# EAGLE schematic DynoHub (EAGLE 9.6.2)
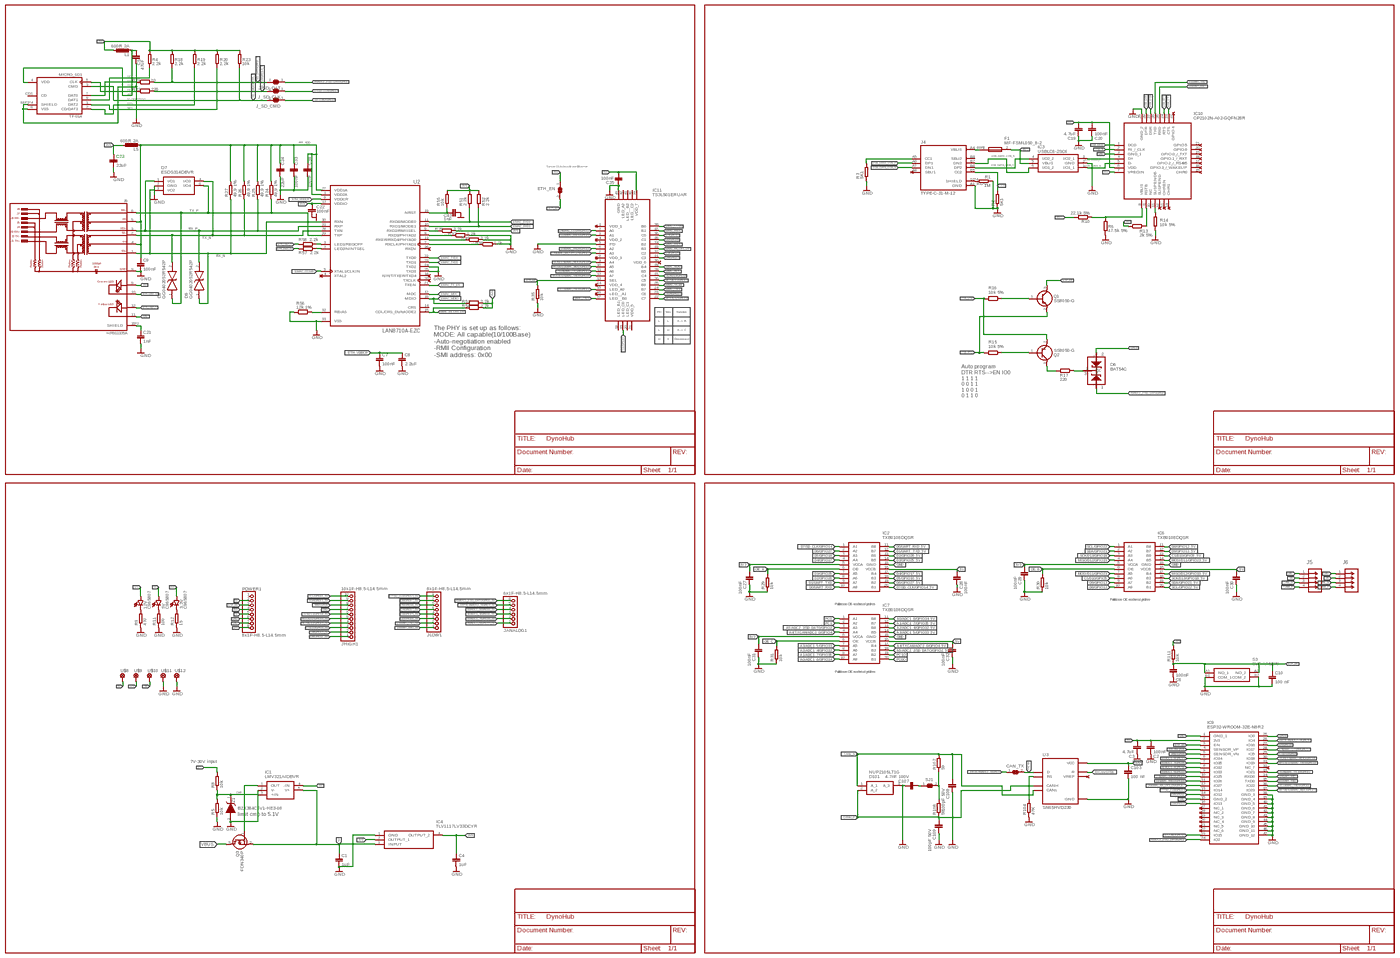
[diagram p0: schematic, sheet 1, overview]
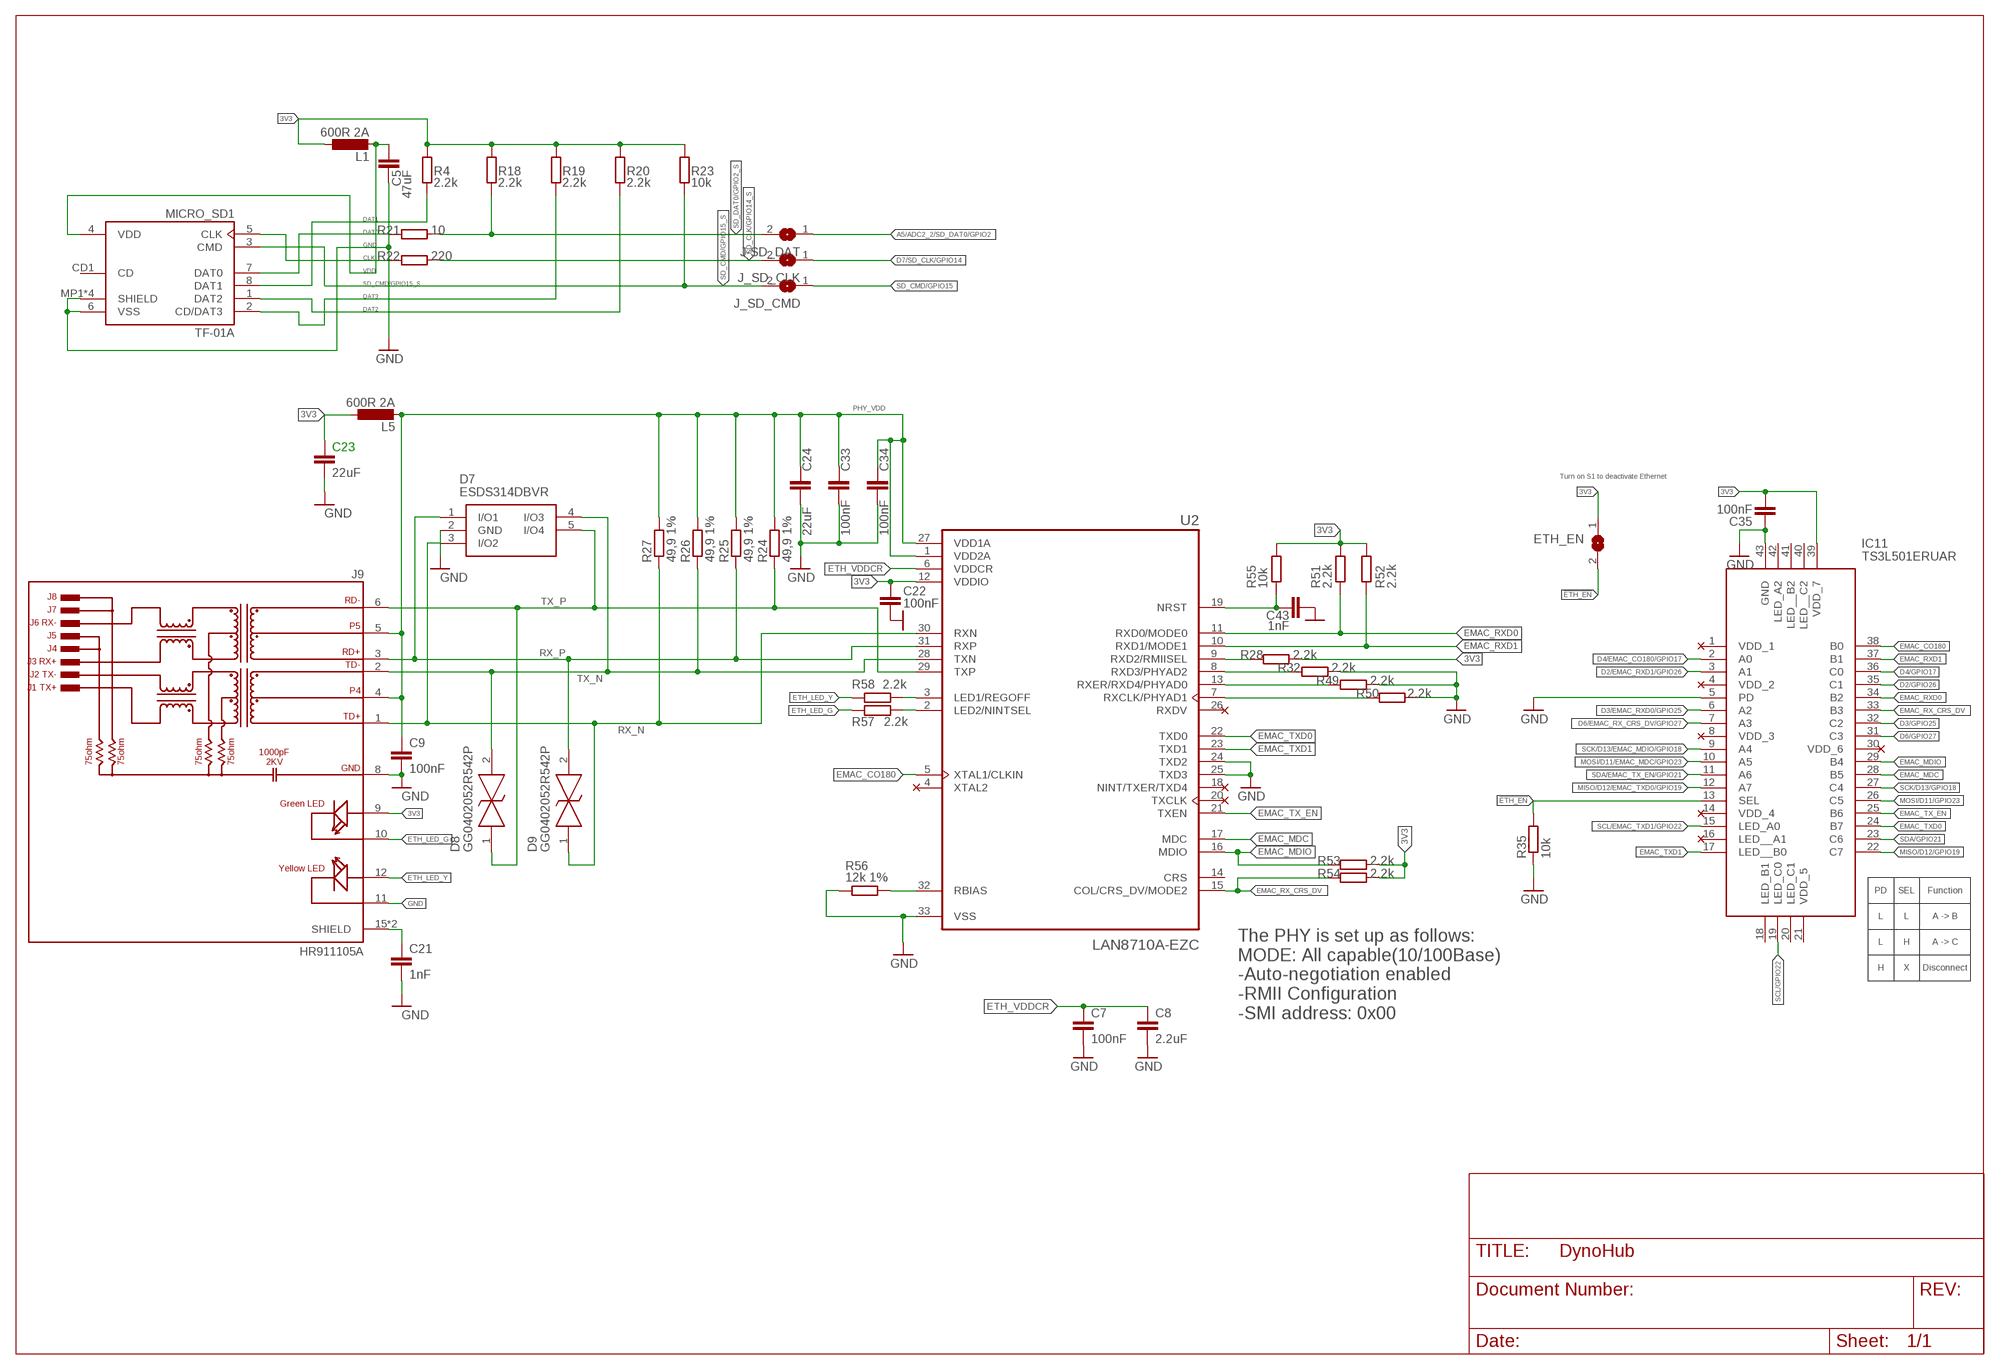
[diagram p1: schematic, sheet 1, part 1 of 4]
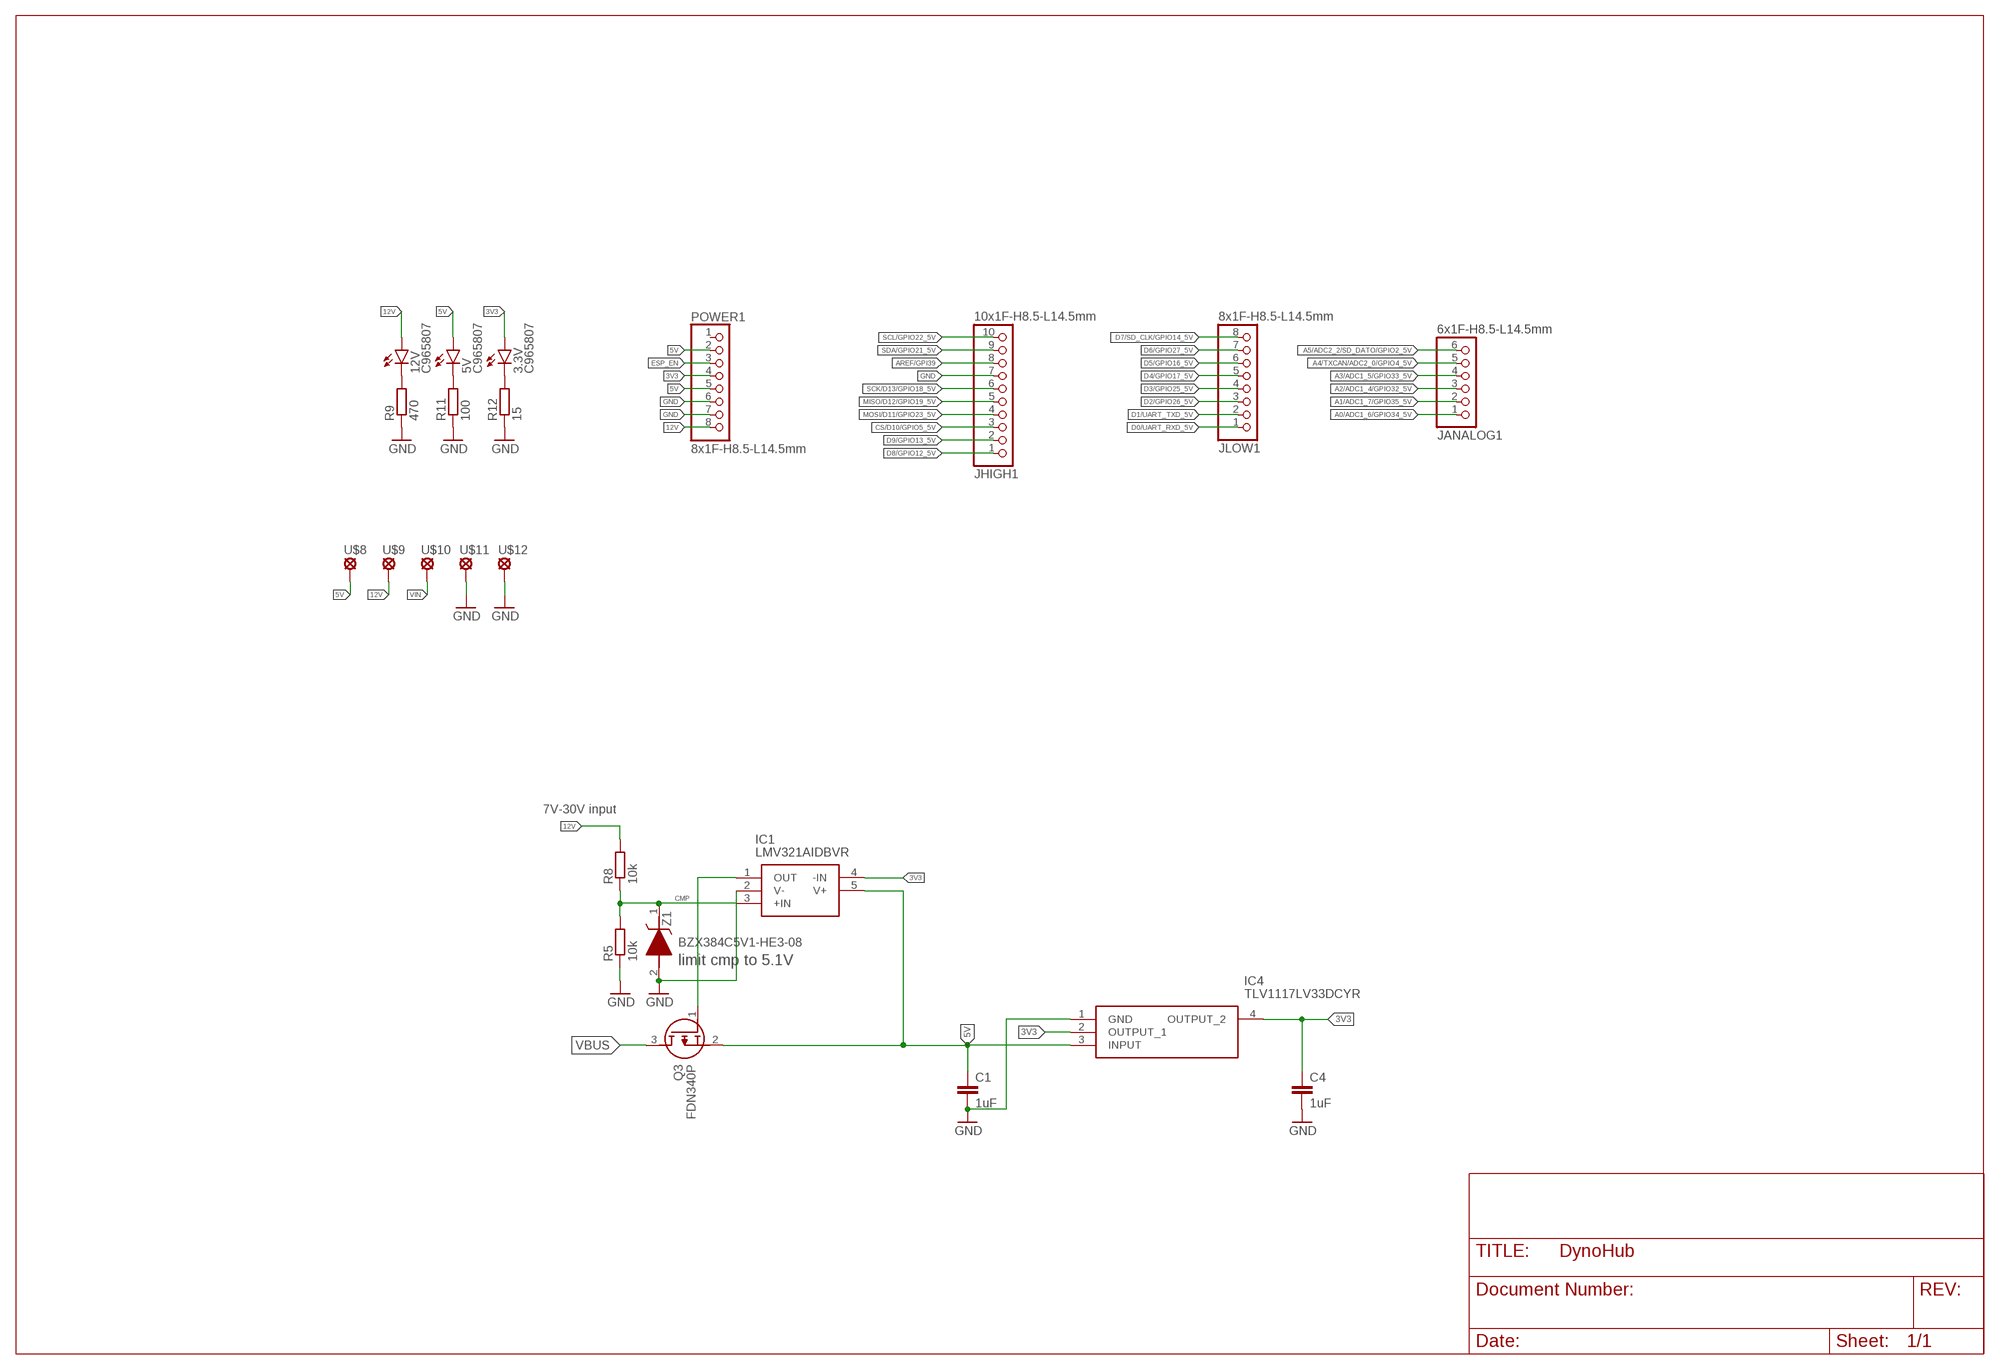
[diagram p2: schematic, sheet 1, part 2 of 4]
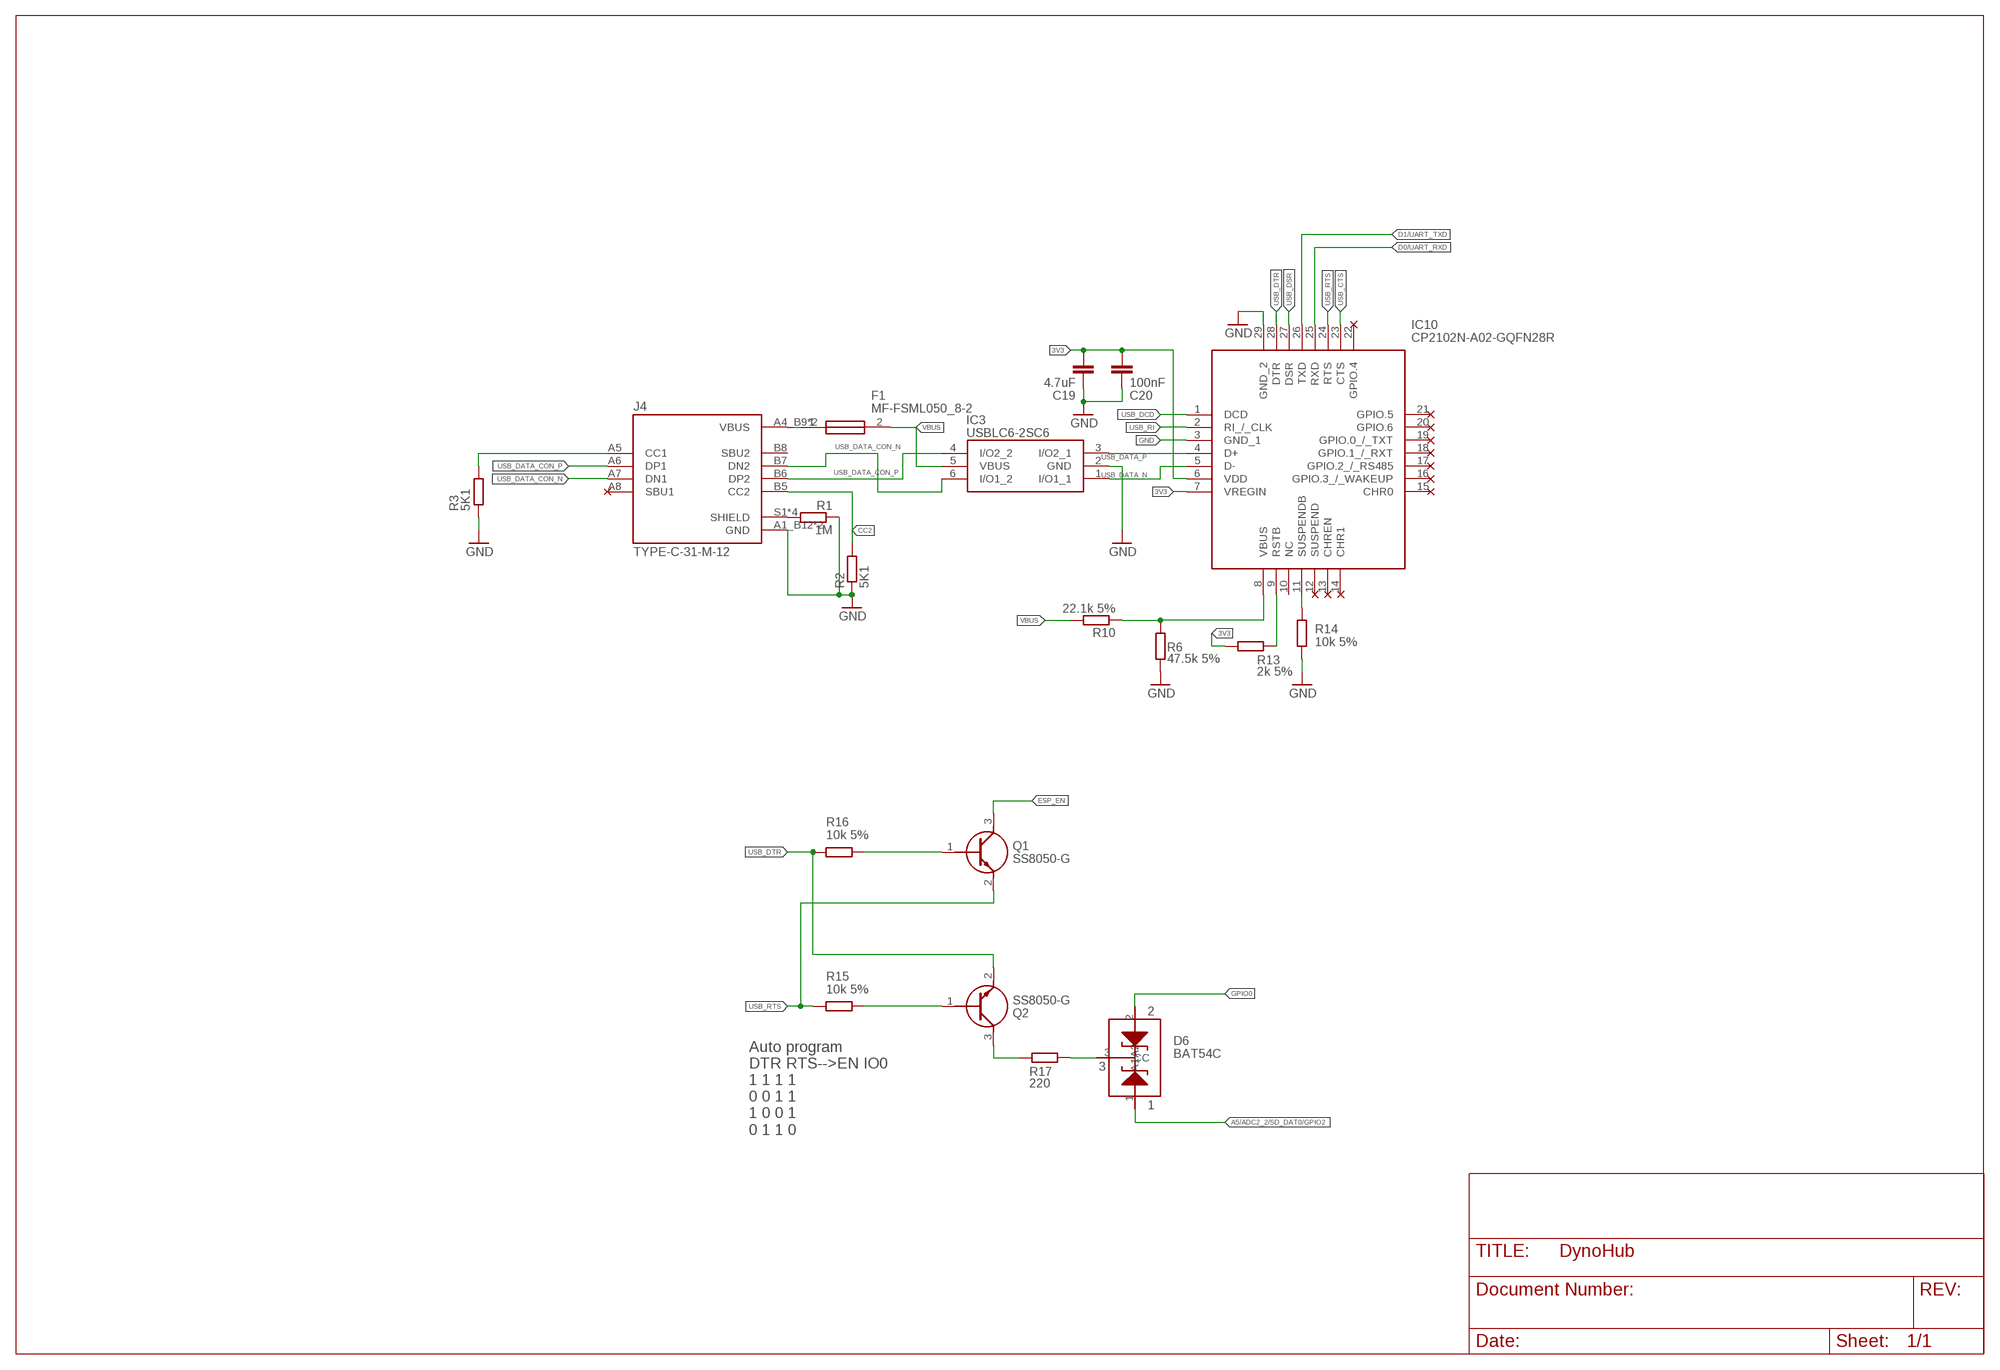
[diagram p3: schematic, sheet 1, part 3 of 4]
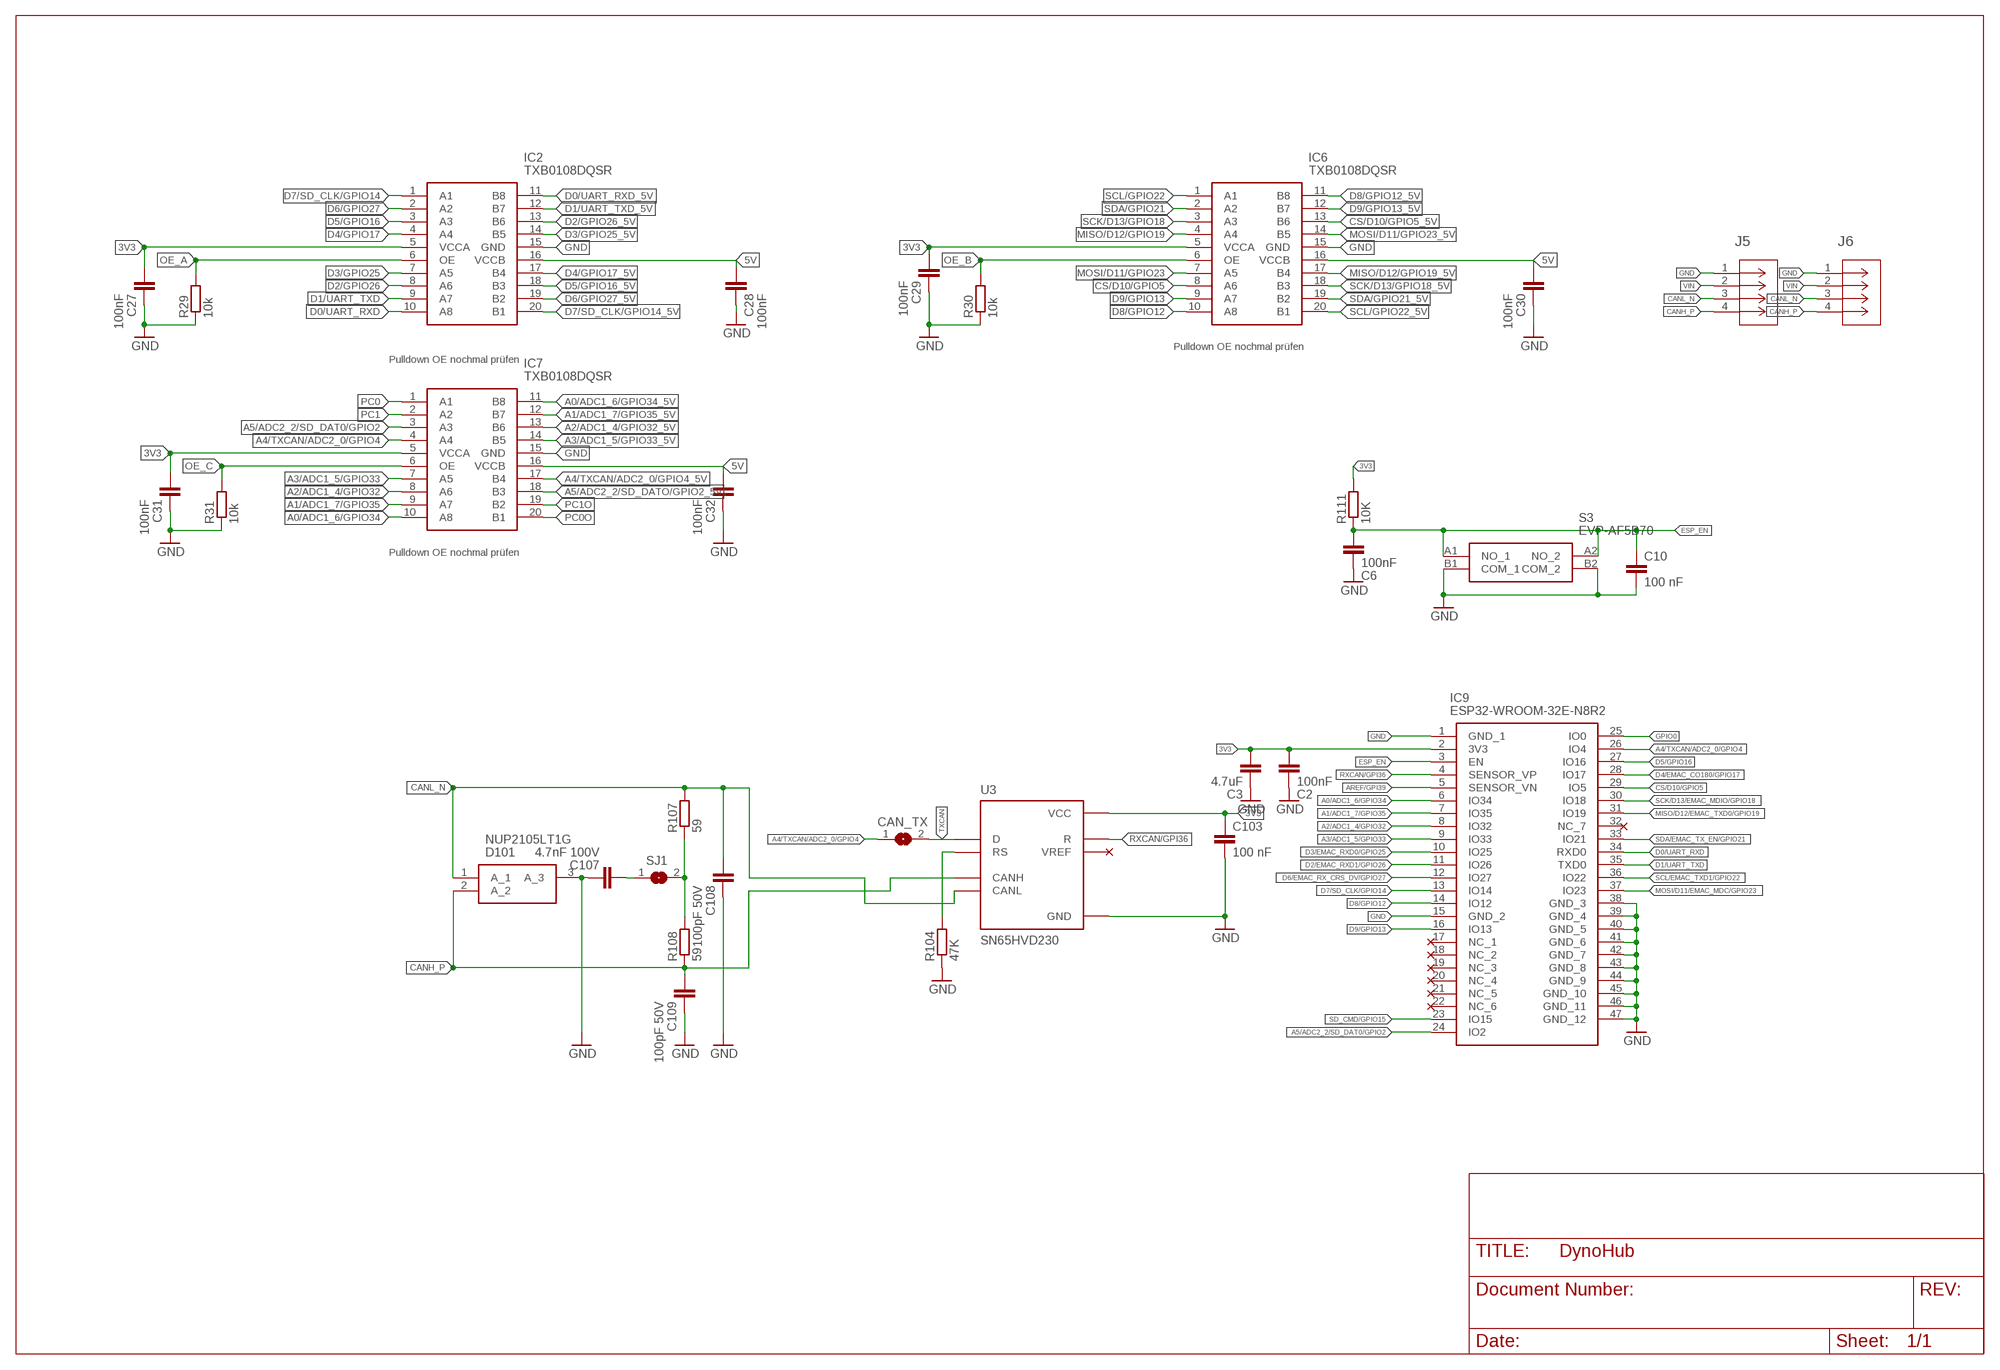
[diagram p4: schematic, sheet 1, part 4 of 4]

## Parts
3.3V  C965807  LEDCHIPLED_0603  [CHIPLED_0603]
5V  C965807  LEDCHIPLED_0603  [CHIPLED_0603]
12V  C965807  LEDCHIPLED_0603  [CHIPLED_0603]
C1  1uF  C-EUC0603  [C0603]
C2  100nF  C-EUC0402K  [C0402K]
C3  4.7uF  C-EUC0402K  [C0402K]
C4  1uF  C-EUC0603  [C0603]
C5  47uF  C-EUC0805  [C0805]
C6  100nF  C-EUC0402K  [C0402K]
C7  100nF  C-EUC0402K  [C0402K]
C8  2.2uF  C-EUC0402K  [C0402K]
C9  100nF  C-EUC0402K  [C0402K]
C10  100 nF  C-EUC0402K  [C0402K]
C19  4.7uF  C-EUC0603  [C0603]
C20  100nF  C-EUC0402K  [C0402K]
C21  1nF  C-EUC0402K  [C0402K]
C22  100nF  C-EUC0402K  [C0402K]
C23  22uF  C-EUC0603  [C0603]
C24  22uF  C-EUC0603  [C0603]
C27  100nF  C-EUC0603  [C0603]
C28  100nF  C-EUC0603  [C0603]
C29  100nF  C-EUC0402K  [C0402K]
C30  100nF  C-EUC0402K  [C0402K]
C31  100nF  C-EUC0603  [C0603]
C32  100nF  C-EUC0603  [C0603]
C33  100nF  C-EUC0402K  [C0402K]
C34  100nF  C-EUC0402K  [C0402K]
C35  100nF  C-EUC0402K  [C0402K]
C43  1nF  C-EUC0402K  [C0402K]
C103  100 nF  C-EUC0402K  [C0402K]
C107  4.7nF 100V  C-EUC0603  [C0603]
C108  100pF 50V  C-EUC0603  [C0603]
C109  100pF 50V  C-EUC0603  [C0603]
CAN_TX  SJ  [SJ]
D6  BAT54C  [SOT95P240X120-3N]
D7  ESDS314DBVR  [SOT95P280X145-5N]
D8  GG0402052R542P  [DIONC1006X55N]
D9  GG0402052R542P  [DIONC1006X55N]
D101  NUP2105LT1G  [SOT96P237X111-3N]
ETH_EN  SJ  [SJ]
F1  MF-FSML050_8-2  [FUSC1608X70N]
IC1  LMV321AIDBVR  [SOT95P280X145-5N]
IC2  TXB0108DQSR  [TXB0108DQSR]
IC3  USBLC6-2SC6  [SOT95P280X145-6N]
IC4  TLV1117LV33DCYR  [SOT230P700X180-4N]
IC6  TXB0108DQSR  [TXB0108DQSR]
IC7  TXB0108DQSR  [TXB0108DQSR]
IC9  ESP32-WROOM-32E-N8R2  [ESP32WROOM32EN8R2]
IC10  CP2102N-A02-GQFN28R  [QFN50P500X500X80-29N]
IC11  TS3L501ERUAR  [QFN50P350X900X80-43N]
J4  TYPE-C-31-M-12  [HRO_TYPE-C-31-M-12]
J5  1718570004CONN_SD-171857-0001_M265_04_MO  [CONN_SD-171857-0001_M265_04_MO]
J6  1718570004CONN_SD-171857-0001_M265_04_MO  [CONN_SD-171857-0001_M265_04_MO]
J9  HR911105A  [HANRUN_HR911105A]
J-SD_DAT  SJ  [SJ]
J_SD_CLK  SJ  [SJ]
J_SD_CMD  SJ  [SJ]
JANALOG1  6x1F-H8.5-L14.5mm  PINHD-1X6  [1X06]
JHIGH1  10x1F-H8.5-L14.5mm  PINHD-1X10  [1X10]
JLOW1  8x1F-H8.5-L14.5mm  PINHD-1X8  [1X08]
L1  600R 2A  L-EUL2012C  [L2012C]
L5  600R 2A  L-EUL2012C  [L2012C]
MICRO_SD1  TF-01A  [TF-01A]
POWER1  8x1F-H8.5-L14.5mm  PINHD-1X8  [1X08]
Q1  SS8050-G  [SOT95P240X115-3N]
Q2  SS8050-G  [SOT95P240X115-3N]
Q3  FDN340P  [SOT95P237X112-3N]
R1  1M  R-EU_R0603  [R0603]
R2  5K1  R-EU_R0603  [R0603]
R3  5K1  R-EU_R0603  [R0603]
R4  2.2k  R-EU_R0402  [R0402]
R5  10k  R-EU_R0603  [R0603]
R6  47.5k 5%  R-EU_R0402  [R0402]
R8  10k  R-EU_R0603  [R0603]
R9  470  R-EU_R0603  [R0603]
R10  22.1k 5%  R-EU_R0402  [R0402]
R11  100  R-EU_R0603  [R0603]
R12  15  R-EU_R0603  [R0603]
R13  2k 5%  R-EU_R0402  [R0402]
R14  10k 5%  R-EU_R0402  [R0402]
R15  10k 5%  R-EU_R0402  [R0402]
R16  10k 5%  R-EU_R0402  [R0402]
R17  220  R-EU_R0402  [R0402]
R18  2.2k  R-EU_R0402  [R0402]
R19  2.2k  R-EU_R0402  [R0402]
R20  2.2k  R-EU_R0402  [R0402]
R21  10  R-EU_R0402  [R0402]
R22  220  R-EU_R0402  [R0402]
R23  10k  R-EU_R0402  [R0402]
R24  49,9 1%  R-EU_R0402  [R0402]
R25  49,9 1%  R-EU_R0402  [R0402]
R26  49,9 1%  R-EU_R0402  [R0402]
R27  49,9 1%  R-EU_R0402  [R0402]
R28  2.2k  R-EU_R0402  [R0402]
R29  10k  R-EU_R0603  [R0603]
R30  10k  R-EU_R0402  [R0402]
R31  10k  R-EU_R0603  [R0603]
R32  2.2k  R-EU_R0402  [R0402]
R35  10k  R-EU_R0603  [R0603]
R49  2.2k  R-EU_R0402  [R0402]
R50  2.2k  R-EU_R0402  [R0402]
R51  2.2k  R-EU_R0402  [R0402]
R52  2.2k  R-EU_R0402  [R0402]
R53  2.2k  R-EU_R0603  [R0603]
R54  2.2k  R-EU_R0603  [R0603]
R55  10k  R-EU_R0402  [R0402]
R56  12k 1%  R-EU_R0402  [R0402]
R57  2.2k  R-EU_R0402  [R0402]
R58  2.2k  R-EU_R0402  [R0402]
R104  47K  R-EU_R0603  [R0603]
R107  59  R-EU_R0603  [R0603]
R108  59  R-EU_R0603  [R0603]
R111  10K  R-EU_R0402  [R0402]
S3  EVP-AF5B70  [EVPAF5B70]
SJ1  SJ  [SJ]
U2  LAN8710A-EZC  [QFN50P500X500X100-33N]
U3  SN65HVD230  [SOIC127P599X175-8N]
U$1  NC  [NC]
U$2  NC  [NC]
U$3  NC  [NC]
U$4  NC  [NC]
U$5  NC  [NC]
U$6  NC  [NC]
U$7  NC  [NC]
U$8  2X3MM_PAD  [2X3MM_PAD]
U$9  2X3MM_PAD  [2X3MM_PAD]
U$10  2X3MM_PAD  [2X3MM_PAD]
U$11  2X3MM_PAD  [2X3MM_PAD]
U$12  2X3MM_PAD  [2X3MM_PAD]
U$13  NC  [NC]
U$14  NC  [NC]
U$15  NC  [NC]
U$16  NC  [NC]
U$17  NC  [NC]
U$18  NC  [NC]
U$19  NC  [NC]
U$20  NC  [NC]
U$21  NC  [NC]
U$22  NC  [NC]
U$23  NC  [NC]
U$24  NC  [NC]
U$25  NC  [NC]
U$26  NC  [NC]
U$27  NC  [NC]
U$28  NC  [NC]
U$29  NC  [NC]
U$30  NC  [NC]
U$31  NC  [NC]
U$32  NC  [NC]
U$33  NC  [NC]
U$34  NC  [NC]
U$35  NC  [NC]
Z1  BZX384C5V1-HE3-08  [SOD2713X115N]

## Nets
3V3: 3.3V.A C2.1 C3.1 C4.1 C19.1 C20.1 C22.1 C23.1 C27.2 C29.2 C31.2 C35.2 C103.1 ETH_EN.1 IC1.4(-IN) IC2.5(VCCA) IC4.2(OUTPUT_1) IC4.4(OUTPUT_2) IC6.5(VCCA) IC7.5(VCCA) IC9.2(3V3) IC10.6(VDD) IC10.7(VREGIN) IC11.39(VDD_7) J9.9(GA) L1.1 L5.1 POWER1.4 R4.2 R13.1 R18.2 R19.2 R20.2 R23.2 R28.2 R51.2 R52.2 R53.2 R54.2 R55.2 R111.2 U2.12(VDDIO) U3.3(VCC)
5V: 5V.A C1.1 C28.2 C30.2 C32.2 IC1.5(V+) IC2.16(VCCB) IC4.3(INPUT) IC6.16(VCCB) IC7.16(VCCB) POWER1.2 POWER1.5 Q3.2(S) U$8.P$1(MP)
12V: 12V.A POWER1.8 R8.2 U$9.P$1(MP)
!ETH_EN: ETH_EN.2 IC11.13(SEL) R35.2
A0/ADC1_6/GPIO34: IC7.10(A8) IC9.6(IO34)
A0/ADC1_6/GPIO34_5V: IC7.11(B8) JANALOG1.1
A1/ADC1_7/GPIO35: IC7.9(A7) IC9.7(IO35)
A1/ADC1_7/GPIO35_5V: IC7.12(B7) JANALOG1.2
A2/ADC1_4/GPIO32: IC7.8(A6) IC9.8(IO32)
A2/ADC1_4/GPIO32_5V: IC7.13(B6) JANALOG1.3
A3/ADC1_5/GPIO33: IC7.7(A5) IC9.9(IO33)
A3/ADC1_5/GPIO33_5V: IC7.14(B5) JANALOG1.4
A4/TXCAN/ADC2_0/GPIO4: CAN_TX.1 IC7.4(A4) IC9.26(IO4)
A4/TXCAN/ADC2_0/GPIO4_5V: IC7.17(B4) JANALOG1.5
A5/ADC2_2/SD_DAT0/GPIO2: D6.1(A1) IC7.3(A3) IC9.24(IO2) J-SD_DAT.1
A5/ADC2_2/SD_DATO/GPIO2_5V: IC7.18(B3) JANALOG1.6
AREF/GPI39: IC9.5(SENSOR_VN) JHIGH1.8
CANGND_BF_C: C107.2 SJ1.1
CANH_P [diffpairs]: C109.2 D101.2(A_2) J5.4 J6.4 R108.1 U3.7(CANH)
CANL_BF_JMP: R107.1 R108.2 SJ1.2
CANL_N [diffpairs]: C108.2 D101.1(A_1) J5.3 J6.3 R107.2 U3.6(CANL)
CC1: J4.A5(CC1) R3.2
CC2: J4.B5(CC2) R2.2
CLK: MICRO_SD1.5(CLK) R22.1
CMP: IC1.3(+IN) R5.2 R8.1 Z1.1(K)
CS/D10/GPIO5: IC6.8(A6) IC9.29(IO5)
CS/D10/GPIO5_5V: IC6.13(B6) JHIGH1.3
D0/UART_RXD: IC2.10(A8) IC9.34(RXD0) IC10.25(RXD)
D0/UART_RXD_5V: IC2.11(B8) JLOW1.1
D1/UART_TXD: IC2.9(A7) IC9.35(TXD0) IC10.26(TXD)
D1/UART_TXD_5V: IC2.12(B7) JLOW1.2
D2/EMAC_RXD1/GPIO26: IC9.11(IO26) IC11.3(A1)
D2/GPIO26: IC2.8(A6) IC11.35(C1)
D2/GPIO26_5V: IC2.13(B6) JLOW1.3
D3/EMAC_RXD0/GPIO25: IC9.10(IO25) IC11.6(A2)
D3/GPIO25: IC2.7(A5) IC11.32(C2)
D3/GPIO25_5V: IC2.14(B5) JLOW1.4
D4/EMAC_CO180/GPIO17: IC9.28(IO17) IC11.2(A0)
D4/GPIO17: IC2.4(A4) IC11.36(C0)
D4/GPIO17_5V: IC2.17(B4) JLOW1.5
D5/GPIO16: IC2.3(A3) IC9.27(IO16)
D5/GPIO16_5V: IC2.18(B3) JLOW1.6
D6/EMAC_RX_CRS_DV/GPIO27: IC9.12(IO27) IC11.7(A3)
D6/GPIO27: IC2.2(A2) IC11.31(C3)
D6/GPIO27_5V: IC2.19(B2) JLOW1.7
D7/SD_CLK/GPIO14: IC2.1(A1) IC9.13(IO14) J_SD_CLK.1
D7/SD_CLK/GPIO14_5V: IC2.20(B1) JLOW1.8
D8/GPIO12: IC6.10(A8) IC9.14(IO12)
D8/GPIO12_5V: IC6.11(B8) JHIGH1.1
D9/GPIO13: IC6.9(A7) IC9.16(IO13)
D9/GPIO13_5V: IC6.12(B7) JHIGH1.2
DAT0: MICRO_SD1.7(DAT0) R21.1
DAT1: MICRO_SD1.8(DAT1) R4.1
DAT2: MICRO_SD1.1(DAT2) R20.1
DAT3: MICRO_SD1.2(CD/DAT3) R19.1
EMAC_CO180: IC11.38(B0) U2.5(XTAL1/CLKIN)
EMAC_MDC: IC11.28(B5) U2.17(MDC)
EMAC_MDIO: IC11.29(B4) R53.1 U2.16(MDIO)
EMAC_RX_CRS_DV: IC11.33(B3) R54.1 U2.15(COL/CRS_DV/MODE2)
EMAC_RXD0: IC11.34(B2) R51.1 U2.11(RXD0/MODE0)
EMAC_RXD1: IC11.37(B1) R52.1 U2.10(RXD1/MODE1)
EMAC_TX_EN: IC11.25(B6) U2.21(TXEN)
EMAC_TXD0: IC11.24(B7) U2.22(TXD0)
EMAC_TXD1: IC11.17(LED__B0) U2.23(TXD1)
ESP_EN: C6.1 C10.1 IC9.3(EN) POWER1.3 Q1.3(C) R111.1 S3.A1(NO_1) S3.A2(NO_2)
ETH_LED_G: J9.10(GC) R57.2
ETH_LED_Y: J9.12(YA) R58.2
ETH_VDDCR: C7.1 C8.1 U2.6(VDDCR)
GND: C1.2 C2.2 C3.2 C4.2 C5.1 C6.2 C7.2 C8.2 C9.2 C10.2 C19.2 C20.2 C21.2 C22.2 C23.2 C24.2 C27.1 C28.1 C29.1 C30.1 C31.1 C32.1 C33.2 C34.2 C35.1 C43.2 C103.2 C107.1 C108.1 C109.1 D7.2(GND) D101.3(A_3) IC1.2(V-) IC2.15(GND) IC3.2(GND) IC4.1(GND) IC6.15(GND) IC7.15(GND) IC9.1(GND_1) IC9.15(GND_2) IC9.38(GND_3) IC9.39(GND_4) IC9.40(GND_5) IC9.41(GND_6) IC9.42(GND_7) IC9.43(GND_8) IC9.44(GND_9) IC9.45(GND_10) IC9.46(GND_11) IC9.47(GND_12) IC10.3(GND_1) IC10.29(GND_2) IC11.5(PD) IC11.43(GND) J4.A1_B12(GND) J4.B1_A12(GND) J5.1 J6.1 J9.8(GND) J9.11(YC) JHIGH1.7 MICRO_SD1.6(VSS) MICRO_SD1.MP1(SHIELD) MICRO_SD1.MP2(SHIELD) MICRO_SD1.MP3(SHIELD) MICRO_SD1.MP4(SHIELD) POWER1.6 POWER1.7 R1.1 R2.1 R3.1 R5.1 R6.1 R9.1 R11.1 R12.1 R14.1 R29.1 R30.1 R31.1 R32.2 R35.1 R49.2 R50.2 R56.1 R104.1 S3.B1(COM_1) S3.B2(COM_2) U2.24(TXD2) U2.25(TXD3) U2.33(VSS) U3.2(GND) U$11.P$1(MP) U$12.P$1(MP) Z1.2(A)
GPIO0: D6.2(A2) IC9.25(IO0) Q2.3(C) R17.2
MISO/D12/EMAC_TXD0/GPIO19: IC9.31(IO19) IC11.12(A7)
MISO/D12/GPIO19: IC6.4(A4) IC11.22(C7)
MISO/D12/GPIO19_5V: IC6.17(B4) JHIGH1.5
MOSI/D11/EMAC_MDC/GPIO23: IC9.37(IO23) IC11.10(A5)
MOSI/D11/GPIO23: IC6.7(A5) IC11.26(C5)
MOSI/D11/GPIO23_5V: IC6.14(B5) JHIGH1.4
N$1: J4.S1(SHIELD) J4.S2(SHIELD) J4.S3(SHIELD) J4.S4(SHIELD) R1.2
N$3: IC10.9(RSTB) R13.2
N$4: IC10.11(SUSPENDB) R14.2
N$5: Q1.1(B) R16.1
N$6: 12V.C R9.2
N$7: R104.2 U3.8(RS)
N$8: IC1.1(OUT) Q3.1(G)
N$9: Q2.1(B) R15.1
N$10: D6.3(CC) R17.1
N$12: 5V.C R11.2
N$13: 3.3V.C R12.2
N$14: C21.1 J9.15(SHIELD) J9.16(SHIELD)
N$19: F1.1 J4.A4_B9(VBUS) J4.B4_A9(VBUS)
N$24: R28.1 U2.9(RXD2/RMIISEL)
N$25: R32.1 U2.8(RXD3/PHYAD2)
N$36: R49.1 U2.13(RXER/RXD4/PHYAD0)
N$37: R50.1 U2.7(RXCLK/PHYAD1)
N$38: C43.1 R55.1 U2.19(NRST)
N$39: R56.2 U2.32(RBIAS)
N$40: R58.1 U2.3(LED1/REGOFF)
N$41: R57.1 U2.2(LED2/NINTSEL)
OE_A: IC2.6(OE) R29.2
OE_B: IC6.6(OE) R30.2
OE_C: IC7.6(OE) R31.2
PC0: IC7.1(A1)
PC0O: IC7.20(B1)
PC1: IC7.2(A2)
PC1O: IC7.19(B2)
PHY_VDD: C9.1 C24.1 C33.1 C34.1 J9.4 J9.5 L5.2 R24.2 R25.2 R26.2 R27.2 U2.1(VDD2A) U2.27(VDD1A)
RX_N [diffpairs]: D7.3(I/O2) D9.1 J9.1(TD+) R27.1 U2.30(RXN)
RX_P [diffpairs]: D7.1(I/O1) D9.2 J9.3(RD+) R25.1 U2.31(RXP)
RXCAN/GPI36: IC9.4(SENSOR_VP) U3.4(R)
SCK/D13/EMAC_MDIO/GPIO18: IC9.30(IO18) IC11.9(A4)
SCK/D13/GPIO18: IC6.3(A3) IC11.27(C4)
SCK/D13/GPIO18_5V: IC6.18(B3) JHIGH1.6
SCL/EMAC_TXD1/GPIO22: IC9.36(IO22) IC11.15(LED_A0)
SCL/GPIO22: IC6.1(A1) IC11.19(LED_C0)
SCL/GPIO22_5V: IC6.20(B1) JHIGH1.10
SD_CLK/GPIO14_S: J_SD_CLK.2 R22.2
SD_CMD/GPIO15: IC9.23(IO15) J_SD_CMD.1
SD_CMD/GPIO15_S: J_SD_CMD.2 MICRO_SD1.3(CMD) R23.1
SD_DAT0/GPIO2_S: J-SD_DAT.2 R18.1 R21.2
SDA/EMAC_TX_EN/GPIO21: IC9.33(IO21) IC11.11(A6)
SDA/GPIO21: IC6.2(A2) IC11.23(C6)
SDA/GPIO21_5V: IC6.19(B2) JHIGH1.9
TX_N [diffpairs]: D7.4(I/O3) D8.2 J9.2(TD-) R26.1 U2.28(TXN)
TX_P [diffpairs]: D7.5(I/O4) D8.1 J9.6(RD-) R24.1 U2.29(TXP)
TXCAN: CAN_TX.2 U3.1(D)
USB_CTS: IC10.23(CTS)
USB_DATA_CON_N [diffpairs]: IC3.6(I/O1_2) J4.A7(DN1) J4.B7(DN2)
USB_DATA_CON_P [diffpairs]: IC3.4(I/O2_2) J4.A6(DP1) J4.B6(DP2)
USB_DATA_N [diffpairs]: IC3.1(I/O1_1) IC10.5(D-)
USB_DATA_P [diffpairs]: IC3.3(I/O2_1) IC10.4(D+)
USB_DCD: IC10.1(DCD)
USB_DSR: IC10.27(DSR)
USB_DTR: IC10.28(DTR) Q2.2(E) R16.2
USB_RI: IC10.2(RI_/_CLK)
USB_RTS: IC10.24(RTS) Q1.2(E) R15.2
VBUS: F1.2 IC3.5(VBUS) IC10.8(VBUS) Q3.3(D) R6.2 R10.1 R10.2
VDD: C5.2 L1.2 MICRO_SD1.4(VDD)
VIN: J5.2 J6.2 U$10.P$1(MP)
Unconnected: IC9.17(NC_1) IC9.18(NC_2) IC9.19(NC_3) IC9.20(NC_4) IC9.21(NC_5) IC9.22(NC_6) IC9.32(NC_7) IC10.10(NC) IC10.12(SUSPEND) IC10.13(CHREN) IC10.14(CHR1) IC10.15(CHR0) IC10.16(GPIO.3_/_WAKEUP) IC10.17(GPIO.2_/_RS485) IC10.18(GPIO.1_/_RXT) IC10.19(GPIO.0_/_TXT) IC10.20(GPIO.6) IC10.21(GPIO.5) IC10.22(GPIO.4) IC11.1(VDD_1) IC11.4(VDD_2) IC11.8(VDD_3) IC11.14(VDD_4) IC11.16(LED__A1) IC11.18(LED_B1) IC11.20(LED_C1) IC11.21(VDD_5) IC11.30(VDD_6) IC11.40(LED__C2) IC11.41(LED__B2) IC11.42(LED_A2) J4.A8(SBU1) J4.B8(SBU2) MICRO_SD1.CD1(CD) POWER1.1 U2.4(XTAL2) U2.14(CRS) U2.18(NINT/TXER/TXD4) U2.20(TXCLK) U2.26(RXDV) U3.5(VREF)

## Notes on the sheet
- Turn on S1 to deactivate Ethernet
- PD | SEL | Function
- L | L | A -> B
- L | H | A -> C
- H | X | Disconnect
- The PHY is set up as follows:
  MODE: All capable(10/100Base)
  -Auto-negotiation enabled
  -RMII Configuration
  -SMI address: 0x00
- Auto program
  DTR RTS-->EN IO0
  1 1 1 1
  0 0 1 1
  1 0 0 1
  0 1 1 0
- Pulldown OE nochmal prüfen
- Pulldown OE nochmal prüfen
- Pulldown OE nochmal prüfen
- 7V-30V input
- limit cmp to 5.1V

## Library data of the parts
3.3V 5V 12V = led:LED: LED OSRAM: - CHIPLED LG R971, LG N971, LY N971, LG Q971, LY Q971, LO R971, LY R971 LH N974, LH R974 LS Q976, LO Q976, LY Q976 LO Q996 - Hyper CHIPLED LW Q18S LB Q993, LB Q99A, LB R99A - SideLED LS A670, LO A670, LY A670, LG A670, LP A670 LB A673, LV A673, LT A673, LW A673 LH A674 LY A675 LS A676, LA A676, LO A676, LY A676, LW A676 LS A679, LY A679, LG A679 - Hyper Micro SIDELED® LS Y876, LA Y876, LO Y876, LY Y876 LT Y87S - SmartLED LW L88C, LW L88S LB L89C, LB L89S, LG L890 LS L89K, LO L89K, LY L89K LS L896, LA L896, LO L896, LY L896 - TOPLED LS T670, LO T670, LY T670, LG T670, LP T670 LSG T670, LSP T670, LSY T670, LOP T670, LYG T670 LG T671, LOG T671, LSG T671 LB T673, LV T673, LT T673, LW T673 LH T674 LS T676, LA T676, LO T676, LY T676, LB T676, LH T676, LSB T676, LW T676 LB T67C, LV T67C, LT T67C, LS T67K, LO T67K, LY T67K, LW E67C LS E67B, LA E67B, LO E67B, LY E67B, LB E67C, LV E67C, LT E67C LW T67C LS T679, LY T679, LG T679 LS T770, LO T770, LY T770, LG T770, LP T770 LB T773, LV T773, LT T773, LW T773 LH T774 LS E675, LA E675, LY E675, LS T675 LS T776, LA T776, LO T776, LY T776, LB T776 LHGB T686 LT T68C, LB T68C - Hyper Mini TOPLED® LB M676 - Mini TOPLED Santana® LG M470 LS M47K, LO M47K, LY M47K Source: http://www.osram.convergy.de LUXEON: - LUMILED® LXK2-PW12-R00, LXK2-PW12-S00, LXK2-PW14-U00, LXK2-PW14-V00 LXK2-PM12-R00, LXK2-PM12-S00, LXK2-PM14-U00 LXK2-PE12-Q00, LXK2-PE12-R00, LXK2-PE12-S00, LXK2-PE14-T00, LXK2-PE14-U00 LXK2-PB12-K00, LXK2-PB12-L00, LXK2-PB12-M00, LXK2-PB14-N00, LXK2-PB14-P00, LXK2-PB14-Q00 LXK2-PR12-L00, LXK2-PR12-M00, LXK2-PR14-Q00, LXK2-PR14-R00 LXK2-PD12-Q00, LXK2-PD12-R00, LXK2-PD12-S00 LXK2-PH12-R00, LXK2-PH12-S00 LXK2-PL12-P00, LXK2-PL12-Q00, LXK2-PL12-R00 Source: www.luxeon.com KINGBRIGHT: KA-3528ASYC Source: www.kingbright.com
C1-C9 C19-C24 C33-C35 C43 = rcl:C-EU: CAPACITOR, European symbol; SPICEPREFIX: C
C10 C27-C32 C103 C107-C109 = resistor:C-EU: CAPACITOR, European symbol
CAN_TX ETH_EN J-SD_DAT J_SD_CLK J_SD_CMD SJ1 = jumper:SJ: SMD solder JUMPER
D6 = BAT54C:BAT54C: Schottky Diodes & Rectifiers SOT23 0.2A 30V Schot tky Dblr Source: Datasheet <https://www.arrow.com/en/products/bat54c/rectron>; DESCRIPTION: Schottky Diodes & Rectifiers SOT23 0.2A 30V Schot tky Dblr; HEIGHT: 1.2mm; MANUFACTURER_NAME: Rectron; MANUFACTURER_PART_NUMBER: BAT54C; MOUSER_PART_NUMBER: 583-BAT54C; MOUSER_PRICE-STOCK: https://www.mouser.co.uk/ProductDetail/Rectron/BAT54C?qs=7pEAo90IqNFr3N7U%252BI9%2FzQ%3D%3D
D7 = ESDS314DBVR:ESDS314DBVR: Data-Line Surge and ESD Protection Diode Array Source: Datasheet <http://www.ti.com/lit/gpn/esds314>; DESCRIPTION: Data-Line Surge and ESD Protection Diode Array; HEIGHT: 1.45mm; MANUFACTURER_NAME: Texas Instruments; MANUFACTURER_PART_NUMBER: ESDS314DBVR; MOUSER_PART_NUMBER: 595-ESDS314DBVR; MOUSER_PRICE-STOCK: https://www.mouser.co.uk/ProductDetail/Texas-Instruments/ESDS314DBVR?qs=w%2Fv1CP2dgqpkGBpJKrSLAg%3D%3D
D8 D9 = GG0402052R542P:GG0402052R542P: ESD Suppressors / TVS Diodes SMP Diode 0402 5vdc 2.5 pf <12v clamp@1a Source: Datasheet; DESCRIPTION: ESD Suppressors / TVS Diodes SMP Diode 0402 5vdc 2.5 pf <12v clamp@1a; HEIGHT: 0.55mm; MANUFACTURER_NAME: Kyocera AVX; MANUFACTURER_PART_NUMBER: GG0402052R542P; MOUSER_PART_NUMBER: 581-GG0402052R542P; MOUSER_PRICE-STOCK: https://www.mouser.co.uk/ProductDetail/KYOCERA-AVX/GG0402052R542P?qs=AQlKX63v8RvyHtzj%2F7p1Bg%3D%3D
D101 = NUP2105LT1G:NUP2105LT1G: Dual Line CAN Bus Protector Source: Datasheet <https://www.onsemi.com/pub/Collateral/NUP2105L-D.PDF>; DESCRIPTION: Dual Line CAN Bus Protector; HEIGHT: 1.11mm; MANUFACTURER_NAME: onsemi; MANUFACTURER_PART_NUMBER: NUP2105LT1G; MOUSER_PART_NUMBER: 863-NUP2105LT1G; MOUSER_PRICE-STOCK: https://www.mouser.co.uk/ProductDetail/onsemi/NUP2105LT1G?qs=ZXBb0xZ9WeDHmiHN%252BYKtYA%3D%3D
F1 = MF-FSML050_8-2:MF-FSML050_8-2: Resettable Fuses - PPTC 8V .5A-HD 50A MAX Source: Datasheet <https://www.bourns.com/docs/product-datasheets/mf-fsml-x.pdf>; DESCRIPTION: Resettable Fuses - PPTC 8V .5A-HD 50A MAX; HEIGHT: 0.7mm; MANUFACTURER_NAME: Bourns; MANUFACTURER_PART_NUMBER: MF-FSML050/8-2; MOUSER_PART_NUMBER: 652-MF-FSML050/8-2; MOUSER_PRICE-STOCK: https://www.mouser.co.uk/ProductDetail/Bourns/MF-FSML050-8-2?qs=EBDBlbfErPxKqI2SUcQuNw%3D%3D
IC1 = LMV321AIDBVR:LMV321AIDBVR: Single Low-Voltage, Cost-Optimized Rail-to-Rail Output Operational Amplifier Source: Datasheet <http://www.ti.com/lit/gpn/lmv321a>; DESCRIPTION: Single Low-Voltage, Cost-Optimized Rail-to-Rail Output Operational Amplifier; HEIGHT: 1.45mm; MANUFACTURER_NAME: Texas Instruments; MANUFACTURER_PART_NUMBER: LMV321AIDBVR; MOUSER_PART_NUMBER: 595-LMV321AIDBVR; MOUSER_PRICE-STOCK: https://www.mouser.co.uk/ProductDetail/Texas-Instruments/LMV321AIDBVR?qs=%252BEew9%252B0nqrCVS%252Bjty8rrxA%3D%3D
IC2 IC6 IC7 = TXB0108DQSR:TXB0108DQSR: 8-Bit Bidirectional Voltage-Level Shifter with Auto Direction Sensing and +/-15-kV ESD Protect Source: Datasheet <http://www.ti.com/lit/gpn/txb0108>; DESCRIPTION: 8-Bit Bidirectional Voltage-Level Shifter with Auto Direction Sensing and +/-15-kV ESD Protect; HEIGHT: 0mm; MANUFACTURER_NAME: Texas Instruments; MANUFACTURER_PART_NUMBER: TXB0108DQSR; MOUSER_PART_NUMBER: 595-TXB0108DQSR; MOUSER_PRICE-STOCK: https://www.mouser.co.uk/ProductDetail/Texas-Instruments/TXB0108DQSR?qs=EuM%2FBx4ov4SMZCOlCh%2FWxA%3D%3D
IC3 = USBLC6-2SC6:USBLC6-2SC6: TVS Diode Array Uni-Directional USBLC6-2SC6 17V, SOT-23 6-Pin Source: Datasheet <http://www.st.com/st-web-ui/static/active/en/resource/technical/document/datasheet/CD00050750.pdf>; DESCRIPTION: TVS Diode Array Uni-Directional USBLC6-2SC6 17V, SOT-23 6-Pin; HEIGHT: 1.45mm; MANUFACTURER_NAME: STMicroelectronics; MANUFACTURER_PART_NUMBER: USBLC6-2SC6; MOUSER_PART_NUMBER: 511-USBLC6-2SC6; MOUSER_PRICE-STOCK: https://www.mouser.co.uk/ProductDetail/STMicroelectronics/USBLC6-2SC6?qs=po45yt2pPpu%2FhNIlwQdTlg%3D%3D
IC4 = TLV1117LV33DCYR:TLV1117LV33DCYR: 1-A, Positive Fixed Voltage, Low-Dropout Regulator Source: Datasheet <http://www.ti.com/lit/gpn/tlv1117lv>; DESCRIPTION: 1-A, Positive Fixed Voltage, Low-Dropout Regulator; HEIGHT: 1.8mm; MANUFACTURER_NAME: Texas Instruments; MANUFACTURER_PART_NUMBER: TLV1117LV33DCYR; MOUSER_PART_NUMBER: 595-TLV1117LV33DCYR; MOUSER_PRICE-STOCK: https://www.mouser.co.uk/ProductDetail/Texas-Instruments/TLV1117LV33DCYR?qs=tEz3BkPb1rwzXMb8FiWhow%3D%3D
IC9 = ESP32-WROOM-32E-N8R2:ESP32-WROOM-32E-N8R2: Multiprotocol Modules ESP32-WROOM-32E integrates ESP32-D0WD-V3, with higher stability and safety performance. Source: Datasheet <https://www.espressif.com/sites/default/files/documentation/esp32-wroom-32e_esp32-wroom-32ue_datasheet_en.pdf>; DESCRIPTION: Multiprotocol Modules ESP32-WROOM-32E integrates ESP32-D0WD-V3, with higher stability and safety performance.; HEIGHT: 3.25mm; MANUFACTURER_NAME: Espressif Systems; MANUFACTURER_PART_NUMBER: ESP32-WROOM-32E-N8R2; MOUSER_PART_NUMBER: 356-ESP32WRM32EN8R2; MOUSER_PRICE-STOCK: https://www.mouser.co.uk/ProductDetail/Espressif-Systems/ESP32-WROOM-32E-N8R2?qs=By6Nw2ByBD0mvGJSS3Ohlw%3D%3D
IC10 = CP2102N-A02-GQFN28R:CP2102N-A02-GQFN28R: USB Interface IC USB to UART bridge - QFN28 Source: Datasheet <https://www.silabs.com/documents/public/data-sheets/cp2102n-datasheet.pdf>; DESCRIPTION: USB Interface IC USB to UART bridge - QFN28; HEIGHT: 0.8mm; MANUFACTURER_NAME: Silicon Labs; MANUFACTURER_PART_NUMBER: CP2102N-A02-GQFN28R; MOUSER_PART_NUMBER: 634-CP2102NA02QFN28R; MOUSER_PRICE-STOCK: https://www.mouser.co.uk/ProductDetail/Silicon-Labs/CP2102N-A02-GQFN28R?qs=u16ybLDytRag4qKvSH3fTw%3D%3D
IC11 = TS3L501ERUAR:TS3L501ERUAR: TS3L501ERUAR Texas Instruments, Analogue Switch Octal SPDT, 3 3.6 V, 42-Pin WQFN Source: Datasheet <https://www.ti.com/lit/gpn/TS3L501E>; DESCRIPTION: TS3L501ERUAR Texas Instruments, Analogue Switch Octal SPDT, 3 3.6 V, 42-Pin WQFN; HEIGHT: 0.8mm; MANUFACTURER_NAME: Texas Instruments; MANUFACTURER_PART_NUMBER: TS3L501ERUAR; MOUSER_PART_NUMBER: 595-TS3L501ERUAR; MOUSER_PRICE-STOCK: https://www.mouser.co.uk/ProductDetail/Texas-Instruments/TS3L501ERUAR?qs=1WmUhT%2FVMIO4%2Flsyz%2FLsJg%3D%3D
J4 = TYPE-C-31-M-12:TYPE-C-31-M-12: Check availability <https://pricing.snapeda.com/parts/TYPE-C-31-M-12/HRO%20Electronics%20Co.%2C%20Ltd./view-part?ref=eda>; AVAILABILITY: Not in stock; CHECK_PRICES: https://www.snapeda.com/parts/TYPE-C-31-M-12/HRO+Electronics+Co.%252C+Ltd./view-part/?ref=eda; DESCRIPTION: USB Connectors 24 Receptacle 1 8.94*7.3mm RoHS; MF: HRO Electronics Co., Ltd.; MP: TYPE-C-31-M-12; PACKAGE: Package; PRICE: None; SNAPEDA_LINK: https://www.snapeda.com/parts/TYPE-C-31-M-12/HRO+Electronics+Co.%252C+Ltd./view-part/?ref=snap
J5 J6 = 2025-02-06_21-28-49_Library:1718570004; COPYRIGHT: Copyright (C) 2025 Ultra Librarian. All rights reserved.; MANUFACTURER_PART_NUMBER: 1718570004; MFR_NAME: Molex Connector Corporation
J9 = HR911105A:HR911105A: DIP RJ45 Connector; Check availability <https://pricing.snapeda.com/parts/HR911105A/hanrun/view-part?ref=eda>; AVAILABILITY: In Stock; CHECK_PRICES: https://www.snapeda.com/parts/HR911105A/HanRun/view-part/?ref=eda; MF: hanrun; MP: HR911105A; PACKAGE: None; PRICE: None; SNAPEDA_LINK: https://www.snapeda.com/parts/HR911105A/HanRun/view-part/?ref=snap
JANALOG1 = pinhead:PINHD-1X6: PIN HEADER
JHIGH1 = SmartPrj:PINHD-1X10: PIN HEADER
JLOW1 POWER1 = SmartPrj:PINHD-1X8: PIN HEADER
L1 L5 = rcl:L-EU: INDUCTOR, European symbol; SPICEPREFIX: L
MICRO_SD1 = TF-01A:TF-01A: Check availability <https://pricing.snapeda.com/parts/TF-01A/HRO%20Electronics%20Co.%2C%20Ltd./view-part?ref=eda>; AVAILABILITY: Not in stock; CHECK_PRICES: https://www.snapeda.com/parts/TF-01A/HRO+Electronics+Co.%252C+Ltd./view-part/?ref=eda; DESCRIPTION: Standard Card Edge Connectors; MF: HRO Electronics Co., Ltd.; MP: TF-01A; PACKAGE: Package; PRICE: None; SNAPEDA_LINK: https://www.snapeda.com/parts/TF-01A/HRO+Electronics+Co.%252C+Ltd./view-part/?ref=snap
Q1 Q2 = SS8050-G:SS8050-G: Bipolar Transistors - BJT NPN TRANSISTOR 1.5A 40V Source: Datasheet <https://datasheet.datasheetarchive.com/originals/distributors/DKDS-12/229454.pdf>; DESCRIPTION: Bipolar Transistors - BJT NPN TRANSISTOR 1.5A 40V; HEIGHT: 1.15mm; MANUFACTURER_NAME: Comchip Technology; MANUFACTURER_PART_NUMBER: SS8050-G; MOUSER_PART_NUMBER: 750-SS8050-G; MOUSER_PRICE-STOCK: https://www.mouser.co.uk/ProductDetail/Comchip-Technology/SS8050-G?qs=LLUE9lz1YbcHg%252BWLMAtcrQ%3D%3D
Q3 = FDN340P:FDN340P: Trans MOSFET P-CH 20V 2A 3-Pin SuperSOT Source: Datasheet <https://www.onsemi.com/pub/Collateral/FDN340P-D.PDF>; DESCRIPTION: Trans MOSFET P-CH 20V 2A 3-Pin SuperSOT; HEIGHT: 1.12mm; MANUFACTURER_NAME: onsemi; MANUFACTURER_PART_NUMBER: FDN340P; MOUSER_PART_NUMBER: 512-FDN340P; MOUSER_PRICE-STOCK: https://www.mouser.co.uk/ProductDetail/onsemi-Fairchild/FDN340P?qs=AMp2PTjoga9dhzFXRaqTZw%3D%3D
R1-R3 R5 R8 R9 R11 R12 R29-R31 R35 R104 R107 R108 = resistor:R-EU_: RESISTOR, European symbol
R4 R6 R10 R13-R28 R32 R49-R58 R111 = rcl:R-EU_: RESISTOR, European symbol; SPICEPREFIX: R
S3 = EVP-AF5B70:EVP-AF5B70: Tactile Switch SPST-NO Top Actuated Surface Mount Source: Datasheet <https://www3.panasonic.biz/ac/cdn/e/control/switch/light-touch/catalog/sw_lt_eng_3026s.pdf>; DESCRIPTION: Tactile Switch SPST-NO Top Actuated Surface Mount; HEIGHT: 0.8mm; MANUFACTURER_NAME: Panasonic; MANUFACTURER_PART_NUMBER: EVP-AF5B70; MOUSER_PART_NUMBER: 667-EVP-AF5B70; MOUSER_PRICE-STOCK: https://www.mouser.co.uk/ProductDetail/Panasonic/EVP-AF5B70?qs=MNPzkKEzRtQbwLa8o3U%252BRQ%3D%3D
U2 = LAN8710A-EZC:LAN8710A-EZC: None Check availability <https://pricing.snapeda.com/parts/LAN8710A-EZC/Microchip/view-part?ref=eda>; AVAILABILITY: In Stock; CHECK_PRICES: https://www.snapeda.com/parts/LAN8710A-EZC/Microchip/view-part/?ref=eda; DESCRIPTION: 4/4 Transceiver Full MII, RMII 32-QFN-EP (5x5); MF: Microchip; MP: LAN8710A-EZC; PACKAGE: QFN-32 Microchip; PRICE: None; SNAPEDA_LINK: https://www.snapeda.com/parts/LAN8710A-EZC/Microchip/view-part/?ref=snap
U3 = SN65HVD230:SN65HVD230: the sn65hvd230 sn65hvd231 and sn65hvd232 controller area network (can) transceivers are designed for use with the tex... Check availability <https://pricing.snapeda.com/parts/SN65HVD230/Texas%20Instruments/view-part?ref=eda>; AVAILABILITY: Not in stock; CHECK_PRICES: https://www.snapeda.com/parts/SN65HVD230/Texas+Instruments/view-part/?ref=eda; DESCRIPTION: 1/1 Transceiver Half CANbus 8-SOIC; MF: Texas Instruments; MP: SN65HVD230; PACKAGE: SOIC-8 Texas Instruments; PRICE: None; SNAPEDA_LINK: https://www.snapeda.com/parts/SN65HVD230/Texas+Instruments/view-part/?ref=snap
U$1-U$7 U$13-U$35 = CF:NC: No connect symbol
U$8-U$12 = solpad:2X3MM_PAD
Z1 = BZX384C5V1-HE3-08:BZX384C5V1-HE3-08: Zener Diodes 5.1 Volt 0.2W 5% Source: Datasheet <http://www.vishay.com/docs/85764/bzx384.pdf>; DESCRIPTION: Zener Diodes 5.1 Volt 0.2W 5%; HEIGHT: 1.15mm; MANUFACTURER_NAME: Vishay; MANUFACTURER_PART_NUMBER: BZX384C5V1-HE3-08; MOUSER_PART_NUMBER: 78-BZX384C5V1-HE3-08; MOUSER_PRICE-STOCK: https://www.mouser.co.uk/ProductDetail/Vishay-Semiconductors/BZX384C5V1-HE3-08?qs=gwusIctiSnBaPkXmzgGJvQ%3D%3D